# EAGLE design PotenciometersBoard (EAGLE 6.1)
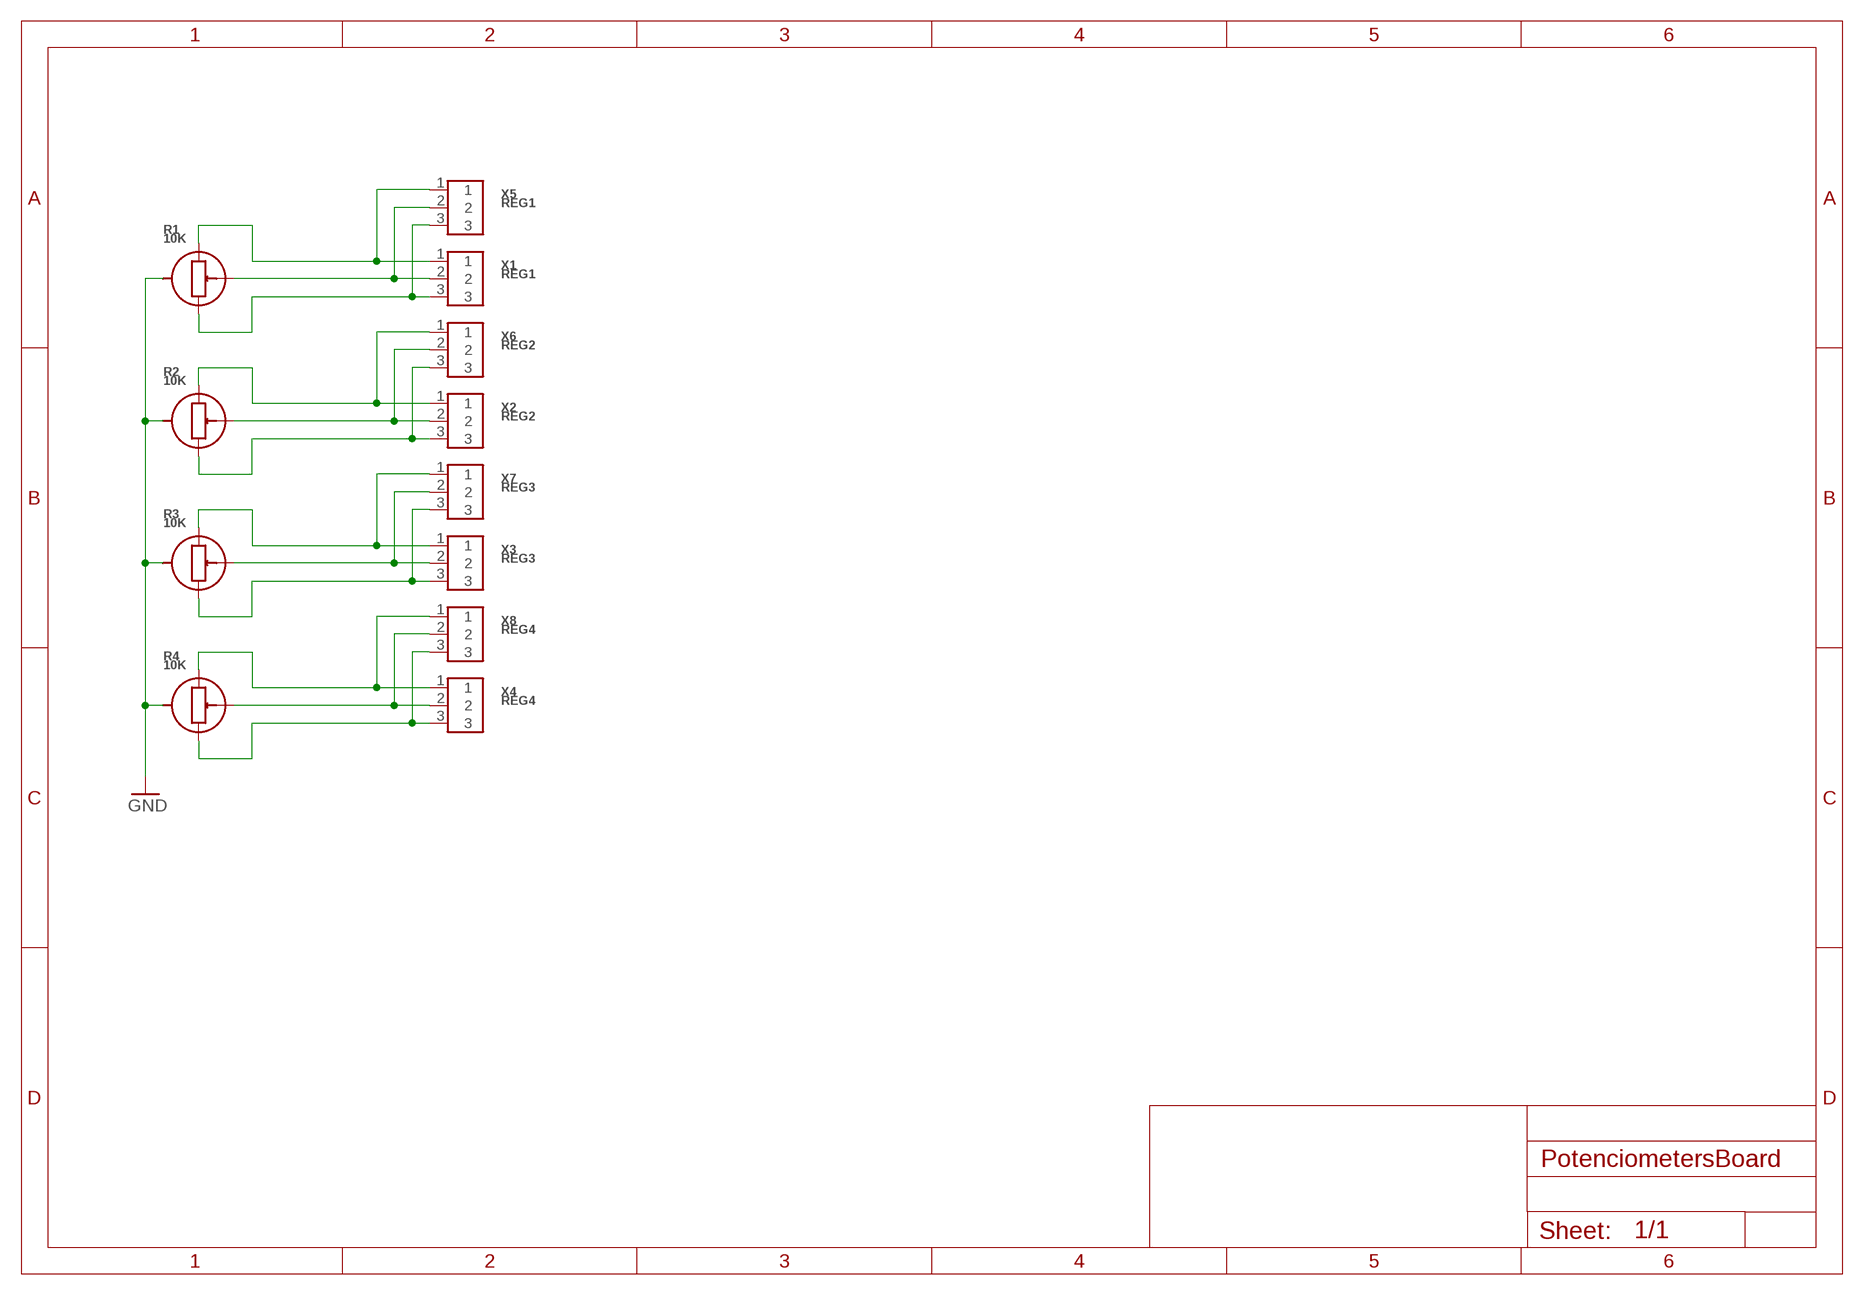
[diagram p0: schematic, sheet 1]

## Parts
R1  10K  R_ADJ_WITH_SHIELDSP4-AM  [SP3-4AM]
R2  10K  R_ADJ_WITH_SHIELDSP4-AM  [SP3-4AM]
R3  10K  R_ADJ_WITH_SHIELDSP4-AM  [SP3-4AM]
R4  10K  R_ADJ_WITH_SHIELDSP4-AM  [SP3-4AM]
X1  REG1  PIN1X3(2.54MM_WITH_CLAMP)  [PIN3X1_2.54MM_WITH_CLAMP]
X2  REG2  PIN1X3(2.54MM_WITH_CLAMP)  [PIN3X1_2.54MM_WITH_CLAMP]
X3  REG3  PIN1X3(2.54MM_WITH_CLAMP)  [PIN3X1_2.54MM_WITH_CLAMP]
X4  REG4  PIN1X3(2.54MM_WITH_CLAMP)  [PIN3X1_2.54MM_WITH_CLAMP]
X5  REG1  PIN1X3(2.54MM_SIDE_BOARD)  [PIN1X3_2.54MM_SIDE_BOARD]
X6  REG2  PIN1X3(2.54MM_SIDE_BOARD)  [PIN1X3_2.54MM_SIDE_BOARD]
X7  REG3  PIN1X3(2.54MM_SIDE_BOARD)  [PIN1X3_2.54MM_SIDE_BOARD]
X8  REG4  PIN1X3(2.54MM_SIDE_BOARD)  [PIN1X3_2.54MM_SIDE_BOARD]

## Nets
GND: R1.PACKAGE1(PACKAGE) R1.PACKAGE2(PACKAGE) R2.PACKAGE1(PACKAGE) R2.PACKAGE2(PACKAGE) R3.PACKAGE1(PACKAGE) R3.PACKAGE2(PACKAGE) R4.PACKAGE1(PACKAGE) R4.PACKAGE2(PACKAGE)
N$1: R1.END_B X1.1 X5.1
N$2: R1.MIDDLE X1.2 X5.2
N$3: R1.END_A X1.3 X5.3
N$4: R2.END_B X2.1 X6.1
N$5: R2.MIDDLE X2.2 X6.2
N$6: R2.END_A X2.3 X6.3
N$7: R3.END_B X3.1 X7.1
N$8: R3.MIDDLE X3.2 X7.2
N$9: R3.END_A X3.3 X7.3
N$10: R4.END_B X4.1 X8.1
N$11: R4.MIDDLE X4.2 X8.2
N$12: R4.END_A X4.3 X8.3

## Library data of the parts
R1-R4 = __MyCommonLib1:R_ADJ_WITH_SHIELD
X1-X8 = __MyCommonLib1:PIN1X3

## Board
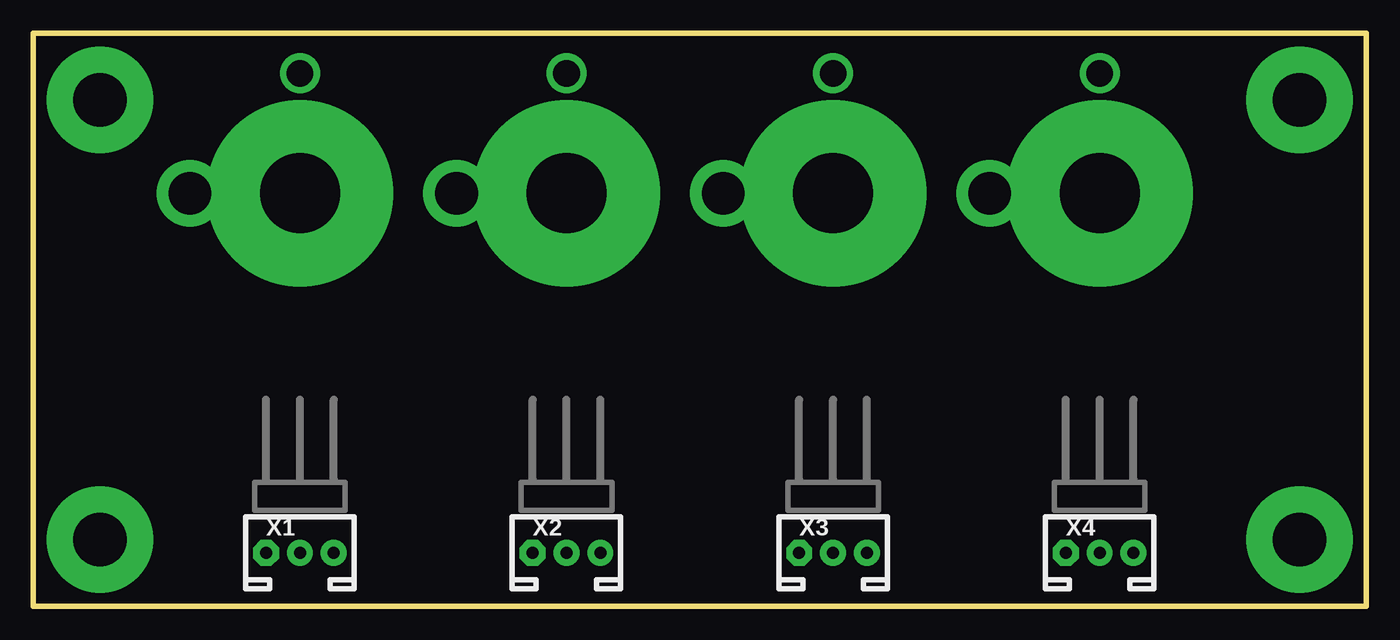
[diagram p1: board, top side]
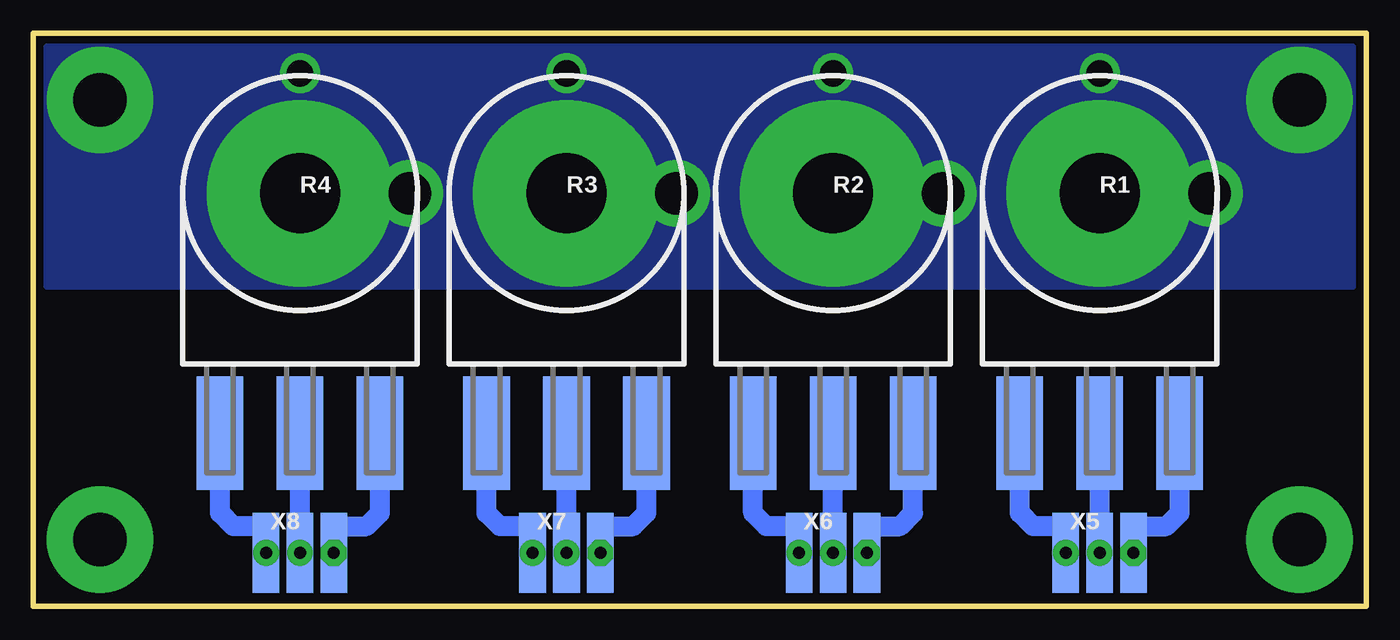
[diagram p2: board, bottom side, seen from below]

Size 100 x 43 mm. Coordinates in mm from the lower left corner, seen from the top.
Outline: 0,0 100,0 100,43 0,43 0,0
Copper layers (1*16): Top 0.035mm / dielectric 1.5mm / Bottom 0.035mm
Design rules: minimum track width 10mil, minimum drill 24mil, track to track 8mil, track to pad 8mil, pad to pad 8mil, via to via 8mil, smd to smd 0mil, copper to edge 0.2mm, drill to drill 8mil, minimum pad ring 10mil, minimum via ring 8mil, stop-mask expansion 4mil, vias tented up to drill 0mil, thermal gap 10mil

### Footprints (pad centres in the part's own frame; a part is rotated, then mirrored left to right if it is on the bottom)
SP3-4AM = smd 3.5 x 8.5: END_A -6,-18; END_B 6,-18; MIDDLE 0,-18 | drill 6 pad 14: PACKAGE1 0,0 | drill 2 pad 3: PACKAGE2 0,9
PIN3X1_2.54MM_WITH_CLAMP = drill 0.9 pad 1.93 octagon: 1 -2.54,0 | drill 0.9 pad 1.93: 2 0,0; 3 2.54,0
PIN1X3_2.54MM_SIDE_BOARD = smd 2 x 6: 1 -2.54,3; 2 0,3; 3 2.54,3

### Placement (x,y rotation side)
R1  20,31 0 bottom
R2  40,31 0 bottom
R3  60,31 0 bottom
R4  80,31 0 bottom
X1  20,4 0 top
X2  40,4 0 top
X3  60,4 0 top
X4  80,4 0 top
X5  20,7 180 bottom
X6  40,7 180 bottom
X7  60,7 180 bottom
X8  80,7 180 bottom

### Tracks (layer width: path | path; a pad name or v marks a point on that pad's centre or on a via)
GND  (via drill 3.2 pad 5, 4 pad 8)
  other vias: 31.75,31 51.75,31 71.75,31 11.75,31 5,38 95,38
  pour Bottom (no thermals): 14,24 99,24 99,42 1,42 1,29 1,24
N$1
  Bottom 1.5: X5.1 17.46,5.54 17,6 15,6 14,7 R1.END_B
N$2
  Bottom 1.5: X5.2 R1.MIDDLE
N$3
  Bottom 1.5: X5.3 22.54,6 25,6 26,7 R1.END_A
N$4
  Bottom 1.5: X6.1 37.46,5.54 37,6 35,6 34,7 R2.END_B
N$5
  Bottom 1.5: X6.2 R2.MIDDLE
N$6
  Bottom 1.5: X6.3 42.54,5.54 43,6 45,6 46,7 R2.END_A
N$7
  Bottom 1.5: X7.1 57.46,5.54 57,6 55,6 54,7 R3.END_B
N$8
  Bottom 1.5: X7.2 R3.MIDDLE
N$9
  Bottom 1.5: X7.3 62.54,5.54 63,6 65,6 66,7 R3.END_A
N$10
  Bottom 1.5: X8.1 77.46,5.54 77,6 75,6 74,7 R4.END_B
N$11
  Bottom 1.5: X8.2 R4.MIDDLE
N$12
  Bottom 1.5: X8.3 82.54,5.54 83,6 85,6 86,7 R4.END_A
N$14  (via drill 4 pad 8)
  other vias: 5,5
N$15  (via drill 4 pad 8)
  other vias: 95,5